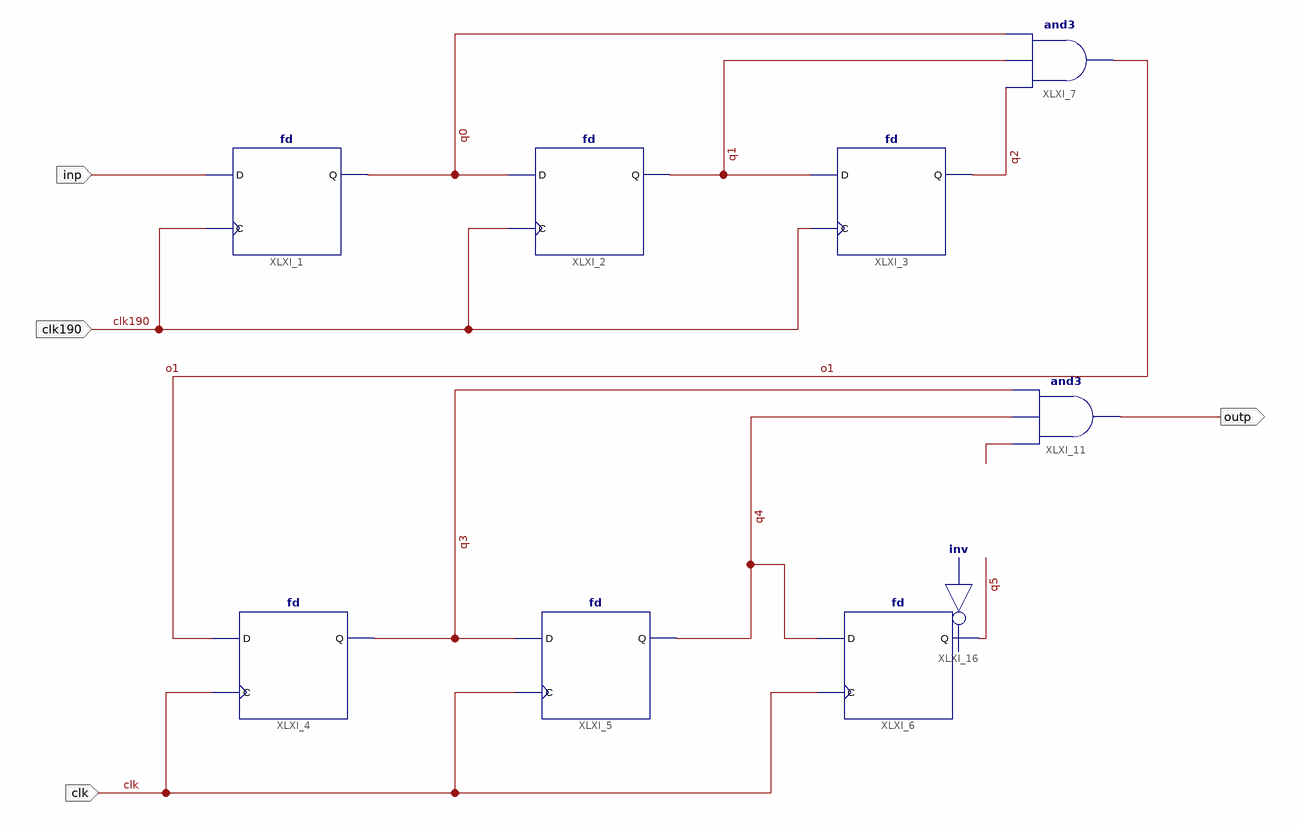
[diagram p0: schematic sheet 1]
// Xilinx ISE schematic pulse.sch (spartan3e) as structural Verilog: 9 symbols, 4 ports
module pulse (
  input  inp,
  input  clk190,
  input  clk,
  output outp
);

  wire o1, q0, q1, q2, q3, q4, q5, XLXN_37;

  fd XLXI_1 (.C(clk190), .D(inp), .Q(q0));
  fd XLXI_2 (.C(clk190), .D(q0), .Q(q1));
  fd XLXI_3 (.C(clk190), .D(q1), .Q(q2));
  and XLXI_7 (o1, q2, q1, q0);
  and XLXI_11 (outp, XLXN_37, q4, q3);
  fd XLXI_4 (.C(clk), .D(o1), .Q(q3));
  fd XLXI_5 (.C(clk), .D(q3), .Q(q4));
  fd XLXI_6 (.C(clk), .D(q4), .Q(q5));
  not XLXI_16 (XLXN_37, q5);
endmodule
